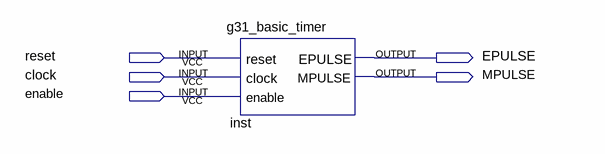
[diagram p0: schematic sheet]
// Quartus schematic g31_basic_timer_circuit.bdf as structural Verilog: 1 symbols, 5 pins
module g31_basic_timer_circuit (
  input  reset,
  input  clock,
  input  enable,
  output EPULSE,
  output MPULSE
);

  g31_basic_timer inst (.reset(reset), .clock(clock), .enable(enable), .EPULSE(EPULSE), .MPULSE(MPULSE));
endmodule
